# Altium schematic sheet EndCap2.SchDoc
size A4
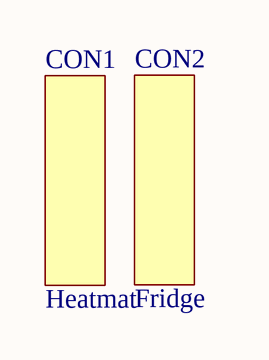
[diagram p0: EndCap2.SchDoc]

## Parts
CON1  Heatmat  [RA-02]
CON2  Fridge  [RA-02]

## Library data of the parts
CON1 CON2 = RA-02: Panel mount mains output socket; Manufacturer Part Number: RA-02